# Altium schematic sheet ethernet.SchDoc
size A3; DocumentNumber: 3; SheetNumber: 3; SheetTotal: 6; PageSetup: Record=PageOptions|CenterHorizontal=True|CenterVertical=True|PrintScale=0.97|XCorrection=1.00|YCorrection=1.00|PrintKind=1|BorderSize=5000000|LeftOffset=0|BottomOffset=0|Orientation=2|PaperLength=2970|PaperWidth=2100|Scale=100|PaperSource=7|PrintQuality=600|MediaType=1|DitherType=10|PaperKind=A4|PrintScaleMode=1
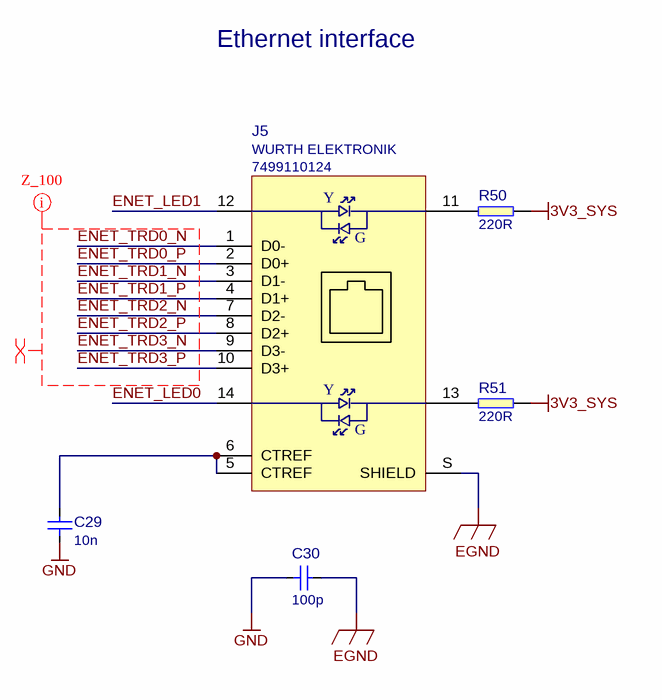
[diagram p0: ethernet.SchDoc]

## Parts
C29  10n  [0603]
C30  100p  [0603]
J5  Manufacturer: WURTH ELEKTRONIK  PartSymbol: 7499110124  [WE_7499110124]  (hidden comment: WE_7499110124)
R50  220R  [0402]
R51  220R  [0402]

## Nets
3V3_SYS: R50.2 R51.1
EGND: C30.2 J5.S(SHIELD)
GND: C29.1 C30.1
ENET_LED0: J5.14
ENET_LED1: J5.12
ENET_TRD0_N: J5.1(D0-)
ENET_TRD0_P: J5.2(D0+)
ENET_TRD1_N: J5.3(D1-)
ENET_TRD1_P: J5.4(D1+)
ENET_TRD2_N: J5.7(D2-)
ENET_TRD2_P: J5.8(D2+)
ENET_TRD3_N: J5.9(D3-)
ENET_TRD3_P: J5.10(D3+)
NetC29_2: C29.2 J5.5(CTREF) J5.6(CTREF)
NetJ5_11: J5.11 R50.1
NetJ5_13: J5.13 R51.2

## Layout directives
net class Z_100: ENET_TRD0_N, ENET_TRD0_P, ENET_TRD1_N, ENET_TRD1_P, ENET_TRD2_N, ENET_TRD2_P, ENET_TRD3_N, ENET_TRD3_P
differential pair: ENET_TRD0_N, ENET_TRD0_P, ENET_TRD1_N, ENET_TRD1_P, ENET_TRD2_N, ENET_TRD2_P, ENET_TRD3_N, ENET_TRD3_P

## Notes on the sheet
- Ethernet interface
- Title:
- Size:
- Date:
- A3
- Revision:
- Page:
- of
- Antmicro Ltd.
- File:
- www.antmicro.com
- (in symbol WE_7499111447) Y; G

## Library data of the parts
C29 = C_10n_0603: MLCC SMT Capacitor 10 nF 0603; Manufacturer: AVX; PartSymbol: 06031C103JAT2A; PartNumber: C_10n_0603; Value: 10n
C30 = C_100p_0603: MLCC SMT Capacitor 100pF 0603; Manufacturer: Walsin; PartSymbol: 0603N101J500CT; PartNumber: C_100p_0603; Value: 100p
J5 = WE_7499111447: LAN-Transformer WE-RJ45LAN 10/100/1000 BaseT; PartNumber: WE_7499110124; Value: WE_7499110124
R50 R51 = R_220R_0402: RES, 220R, 0402; Manufacturer: TE Connectivity; PartSymbol: CRG0402J220R; PartNumber: R_220R_0402; Value: 220R